# EAGLE schematic half_duplex_board (EAGLE 8.4.1)
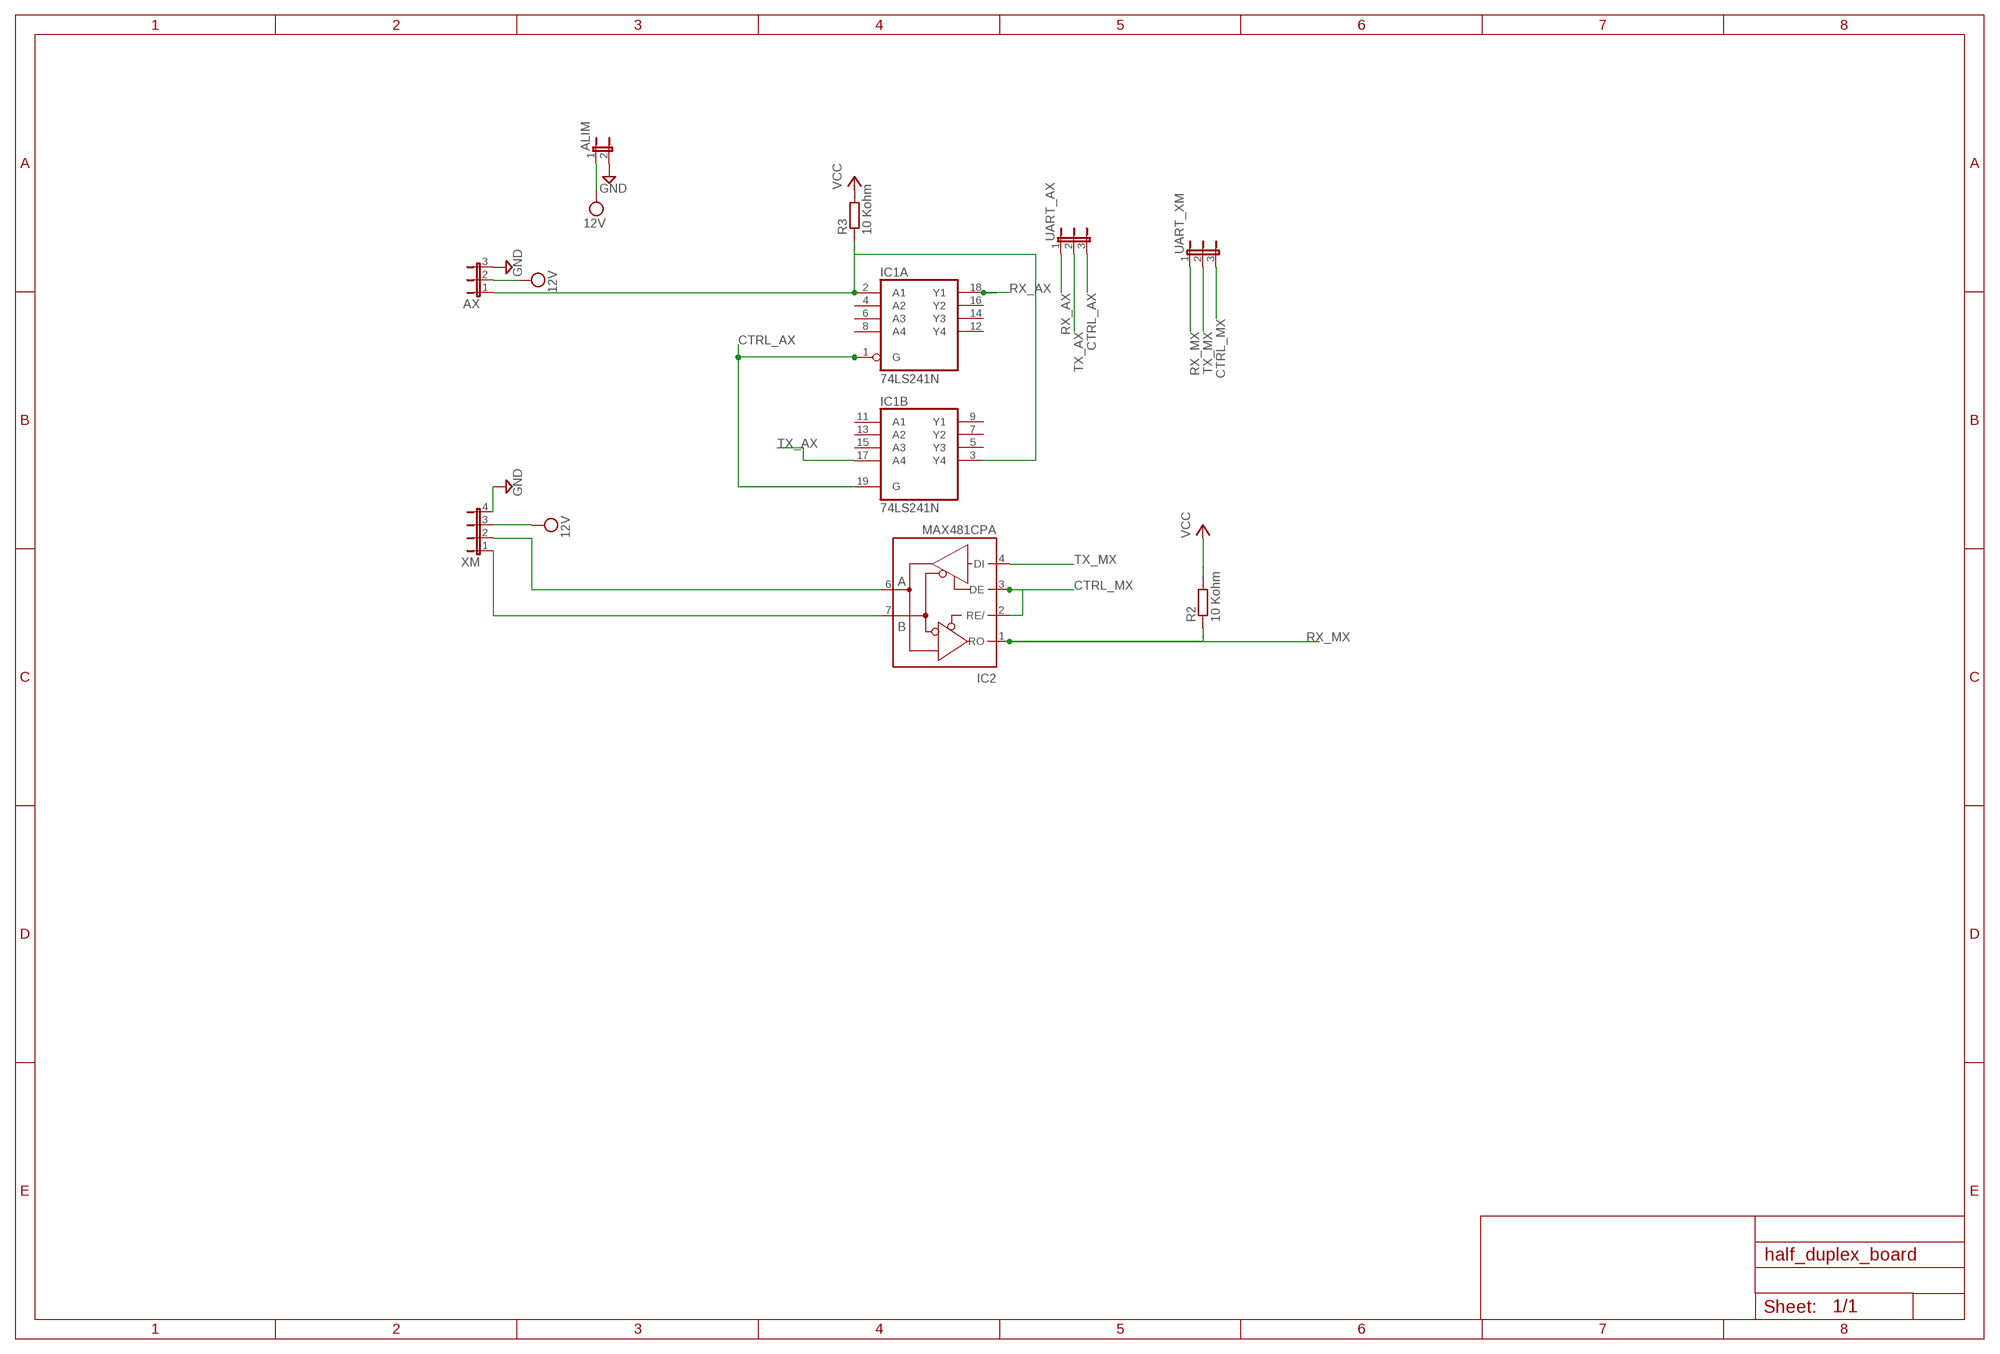
[diagram p0: schematic, sheet 1]

## Parts
ALIM  JP1E  [JP1]
AX  JP2W  [JP2W]
IC1  74LS241N  [DIL20]
IC2  MAX481CPA  [DIL08]
R2  10 Kohm  R0207/10  [0207/10]
R3  10 Kohm  R0207/10  [0207/10]
UART_AX  JP2W  [JP2W]
UART_XM  JP2W  [JP2W]
XM  JP4E  [JP4]

## Nets
CTRL_AX: IC1.1(A:G) IC1.19(B:G)
CTRL_MX: IC2.2(RE/) IC2.3(DE) UART_XM.3
GND: ALIM.2 AX.3 XM.4
N$1: IC2.7(B) XM.1
N$2: IC2.6(A) XM.2
N$3: UART_AX.1
N$4: UART_AX.2
N$5: UART_AX.3
N$6: AX.1 IC1.2(A:A1) IC1.3(B:Y4) R3.1
RX_AX: IC1.18(A:Y1)
RX_MX: IC2.1(RO) R2.1 UART_XM.1
TX_AX: IC1.17(B:A4)
TX_MX: IC2.4(DI) UART_XM.2
VCC: R2.2 R3.2
VDD: ALIM.1 AX.2 XM.3 ; supply symbol labelled 12V
Unconnected: IC1.4(A:A2) IC1.5(B:Y3) IC1.6(A:A3) IC1.7(B:Y2) IC1.8(A:A4) IC1.9(B:Y1) IC1.11(B:A1) IC1.12(A:Y4) IC1.13(B:A2) IC1.14(A:Y3) IC1.15(B:A3) IC1.16(A:Y2)

## Power pins joined to a net without a drawn wire
GND: IC1.10(P:GND) IC2.5(GND)
VCC: IC1.20(P:VCC) IC2.8(VCC)

## Library data of the parts
ALIM = jumper:JP1E: JUMPER
AX UART_AX UART_XM = jumper:JP2W: JUMPER
IC1 = 74xx-eu:74*241: Octal BUFFER and LINE DRIVER, 3-state
IC2 = maxim:MAX481CPA: RS485 TRANSEIVER; MPN: MAX481CPA+; OC_FARNELL: unknown; OC_NEWARK: 99K3445
R2 R3 = eagle-ltspice:R: RESISTOR, European symbol; SPICEMODEL: NONE; SPICEPREFIX: R
XM = jumper:JP4E: JUMPER

## Module PCB
Ports: 

### Library data of the parts